# EAGLE schematic INNO_CAN_V1.1 (EAGLE 7.7.0)

## Sheet 1 of 8: POWER LAYER
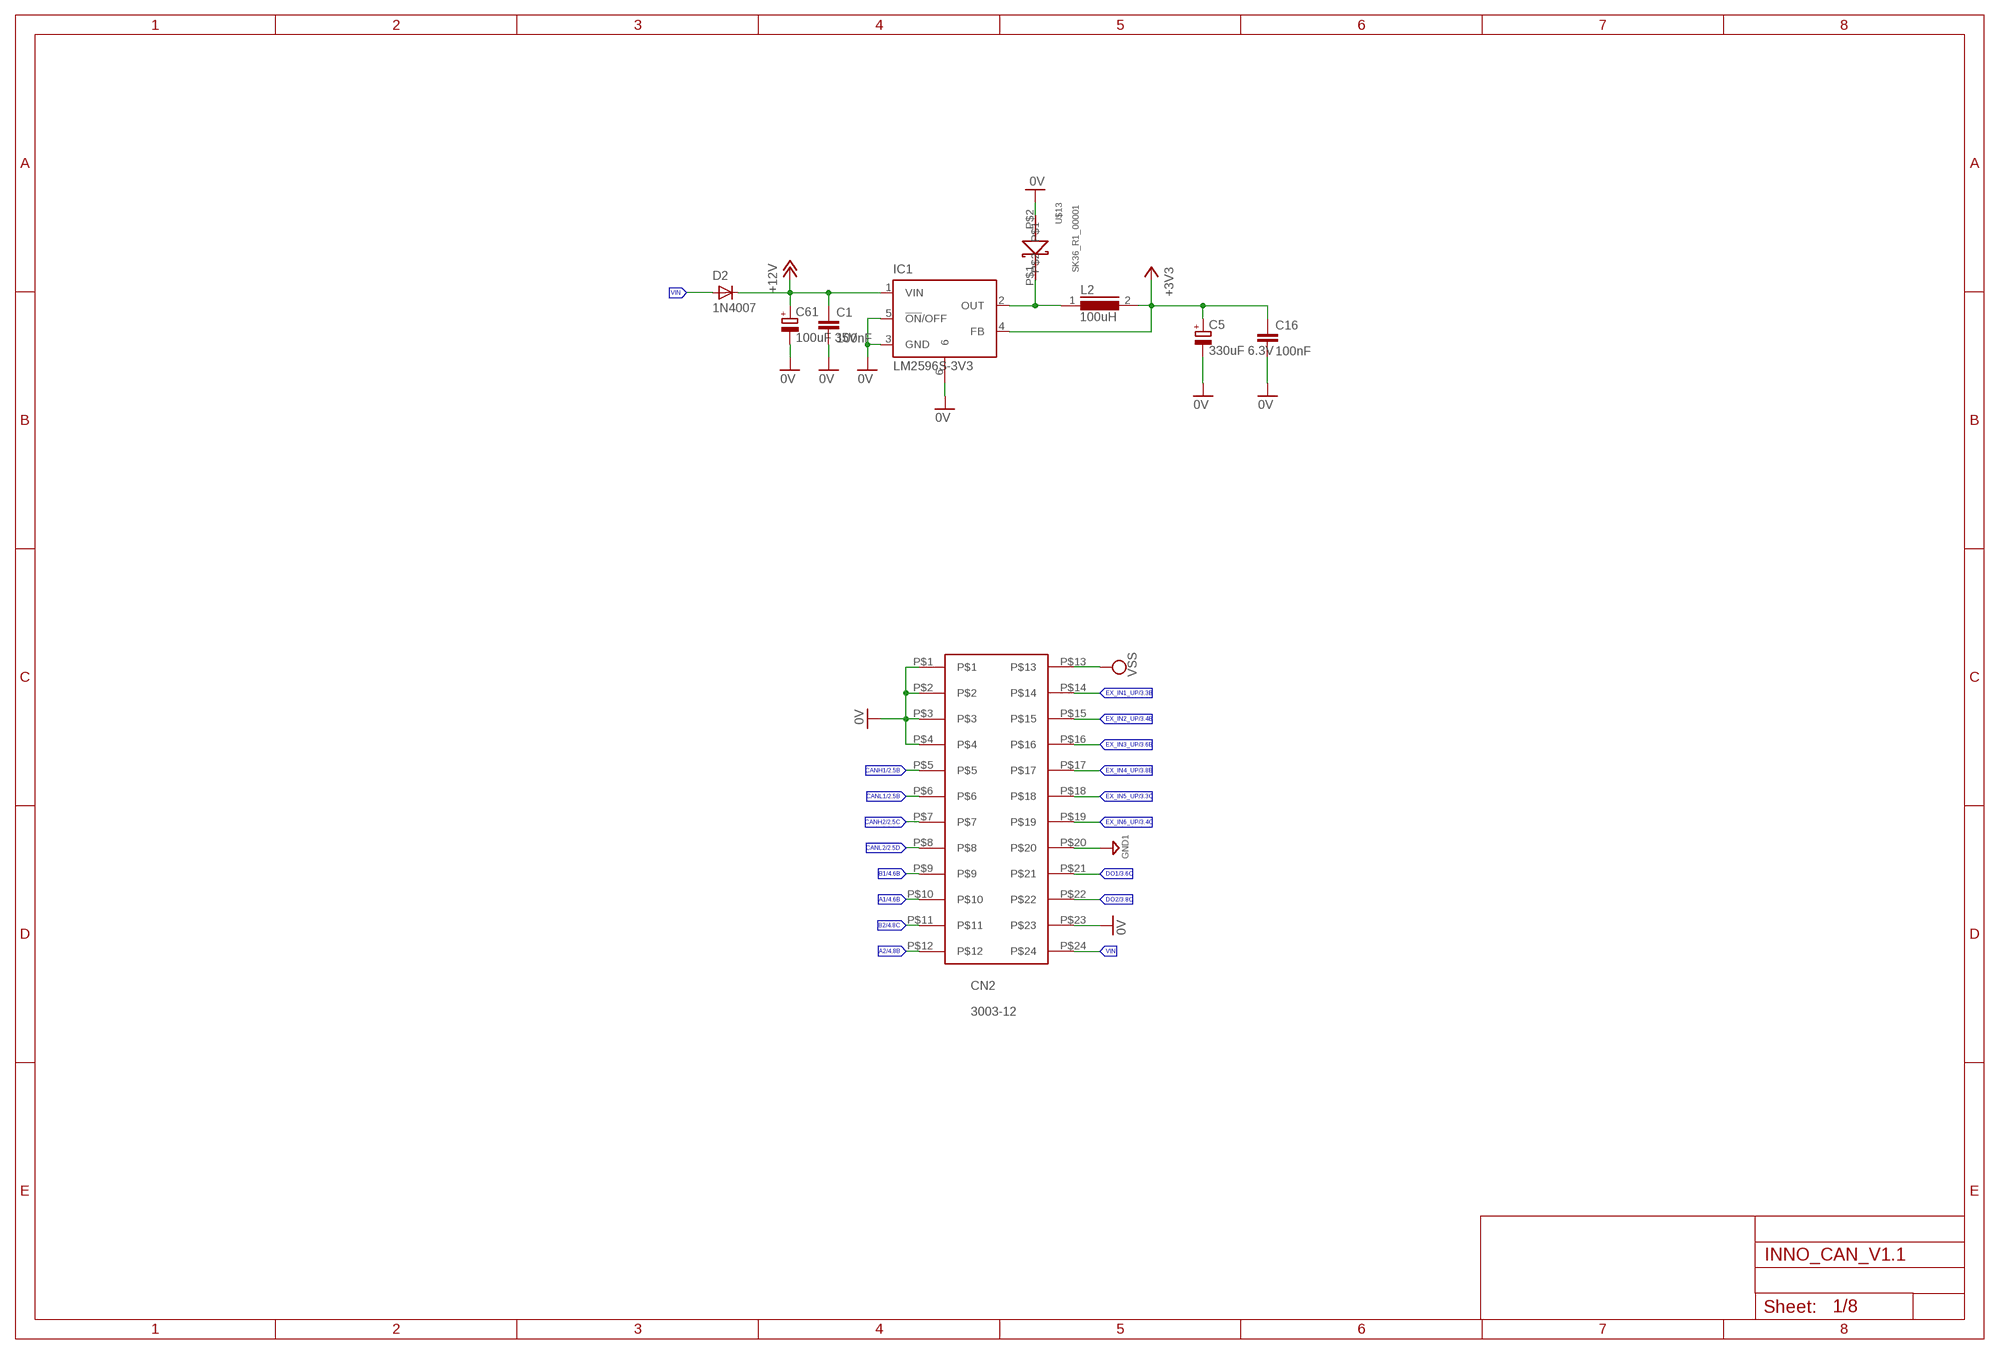
[diagram p0: schematic, sheet 1]

### Parts
C1  100nF  C-EUC0603  [C0603]
C5  330uF 6.3V  CPOL-EUE2.5-6  [E2,5-6]
C16  100nF  C-EUC0603  [C0603]
C61  100uF 35V  CPOL-EUE5-6  [E5-6]
CN2  3003-12  [3003-12]
D2  1N4007  GF1  [SMA-DO214AC]
IC1  LM2596S-3V3  LM2596S  [TO263-5]
L2  100uH  DR127  [DR127]
U$13  SK36_R1_00001  B540C_DIODE  [SMC]

### Nets
0V: C1.2 C5.- C16.2 C61.- CN2.P$1 CN2.P$2 CN2.P$3 CN2.P$4 CN2.P$23 IC1.3(GND) IC1.5(!ON!/OFF) IC1.6 U$13.P$2 ; also sheet 2,3,4,5,6,7,8
+3V3: C5.+ C16.1 IC1.4(FB) L2.2 ; also sheet 3,4,5,6,7,8
+12V: C1.1 C61.+ D2.K(C) IC1.1(VIN) ; also sheet 3
A1: CN2.P$10 ; also sheet 4
A2: CN2.P$12 ; also sheet 4
B1: CN2.P$9 ; also sheet 4
B2: CN2.P$11 ; also sheet 4
CANH1: CN2.P$5 ; also sheet 2
CANH2: CN2.P$7 ; also sheet 2
CANL1: CN2.P$6 ; also sheet 2
CANL2: CN2.P$8 ; also sheet 2
DO1: CN2.P$21 ; also sheet 3
DO2: CN2.P$22 ; also sheet 3
EX_IN1_UP: CN2.P$14 ; also sheet 3
EX_IN2_UP: CN2.P$15 ; also sheet 3
EX_IN3_UP: CN2.P$16 ; also sheet 3
EX_IN4_UP: CN2.P$17 ; also sheet 3
EX_IN5_UP: CN2.P$18 ; also sheet 3
EX_IN6_UP: CN2.P$19 ; also sheet 3
GND1: CN2.P$20 ; also sheet 3
N$216: IC1.2(OUT) L2.1 U$13.P$1
VIN: CN2.P$24 D2.A
VSS: CN2.P$13 ; also sheet 3

## Sheet 2 of 8: CAN LAYER
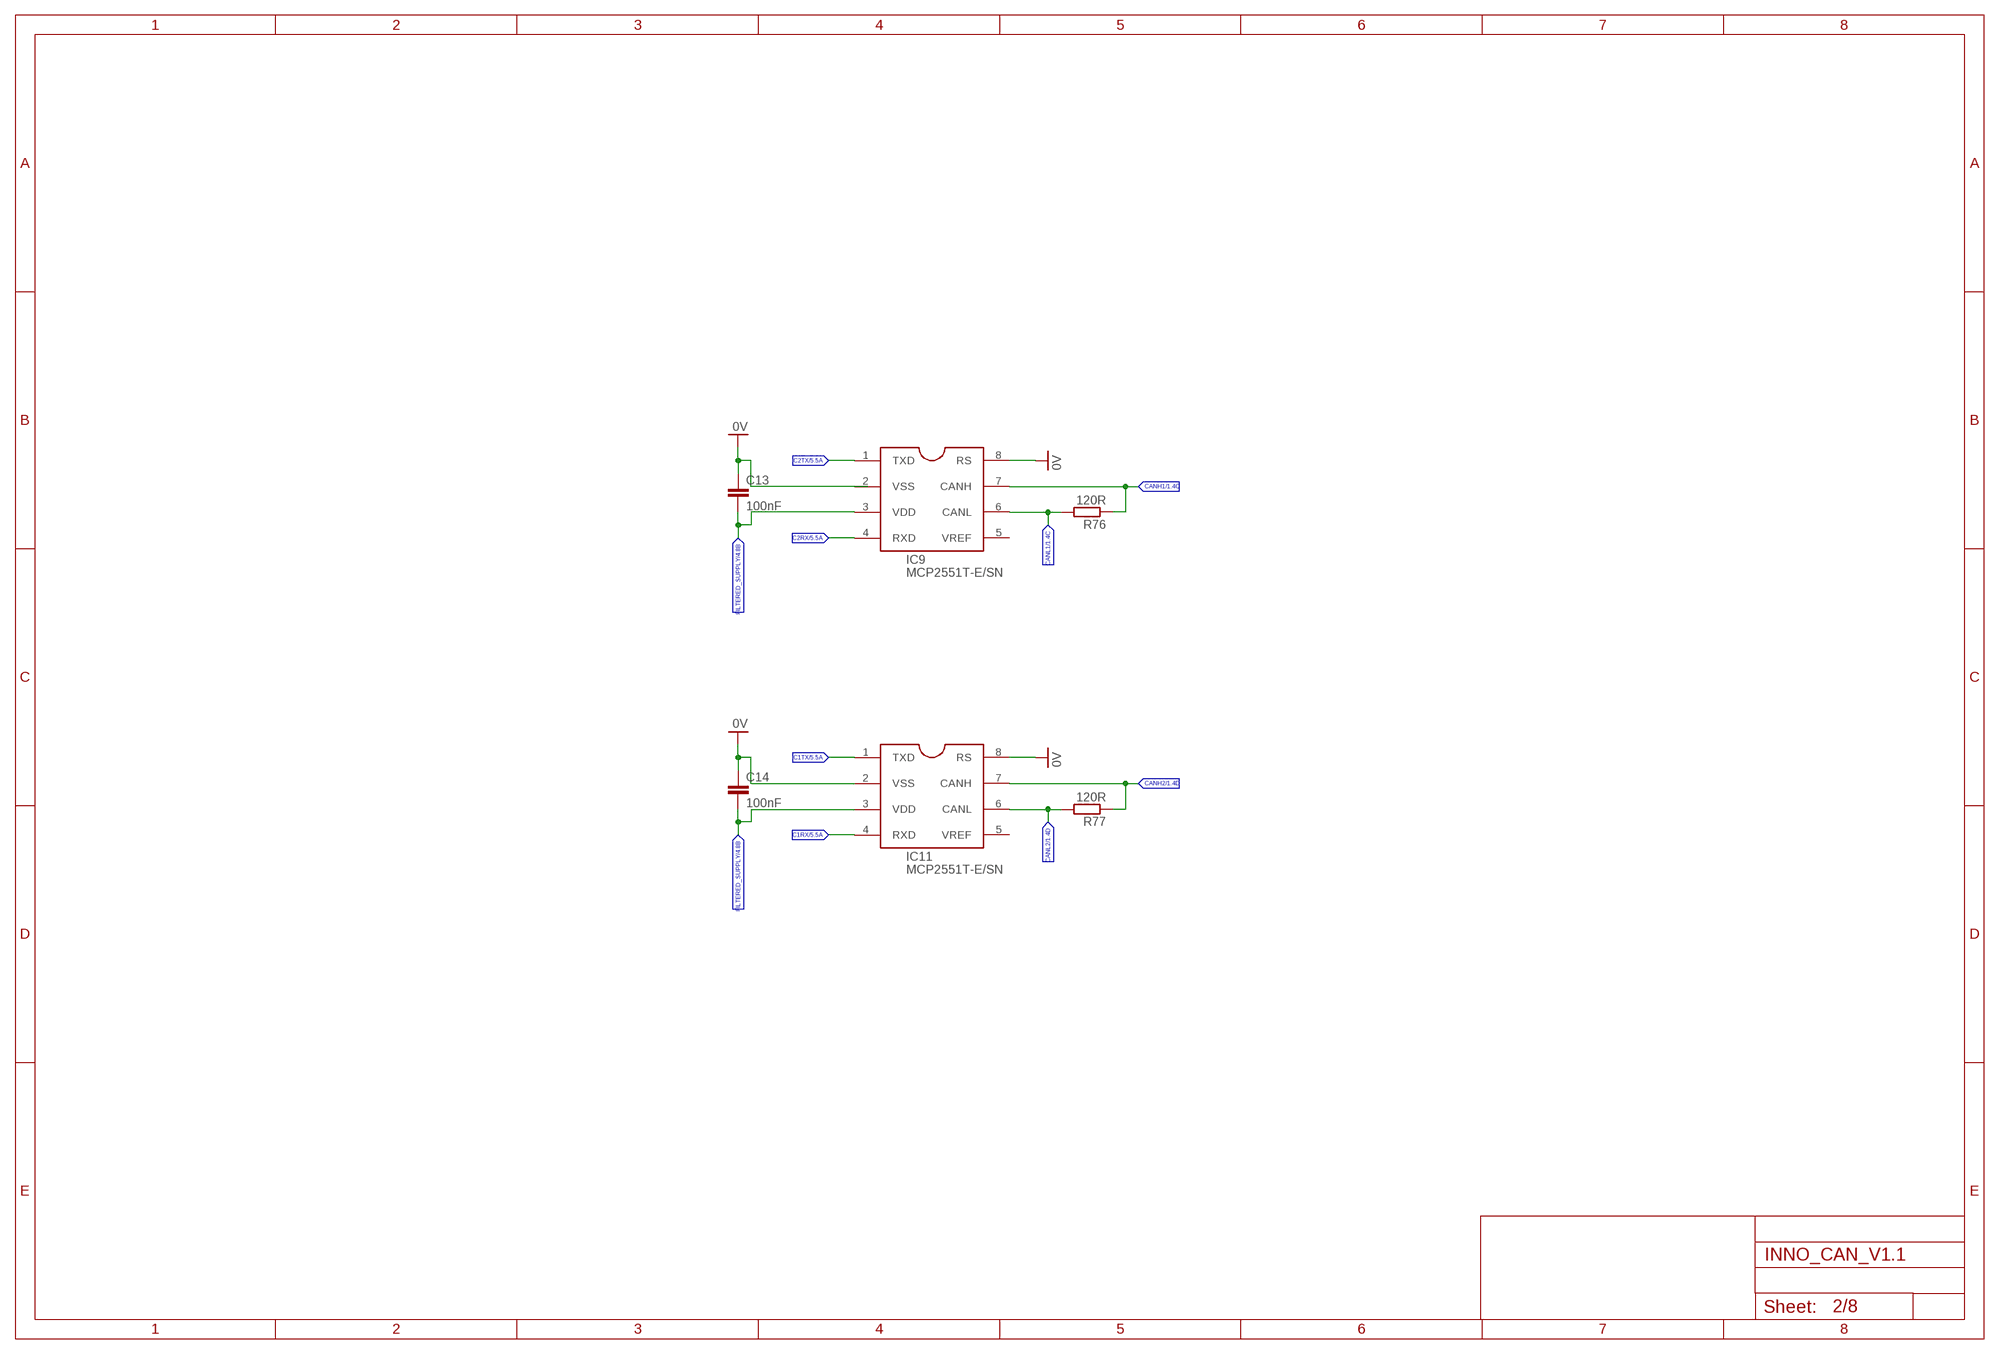
[diagram p1: schematic, sheet 2]

### Parts
C13  100nF  C-EUC0603K  [C0603K]
C14  100nF  C-EUC0603K  [C0603K]
IC9  MCP2551T-E/SN  [SOIC08]
IC11  MCP2551T-E/SN  [SOIC08]
R76  120R  R-EU_R0603  [R0603]
R77  120R  R-EU_R0603  [R0603]

### Nets
0V: C13.1 C14.1 IC9.8(RS) IC11.2(VSS) IC11.8(RS) ; also sheet 1,3,4,5,6,7,8
C1RX: IC11.4(RXD) ; also sheet 5
C1TX: IC11.1(TXD) ; also sheet 5
C2RX: IC9.4(RXD) ; also sheet 5
C2TX: IC9.1(TXD) ; also sheet 5
CANH1: IC9.7(CANH) R76.1 ; also sheet 1
CANH2: IC11.7(CANH) R77.1 ; also sheet 1
CANL1: IC9.6(CANL) R76.2 ; also sheet 1
CANL2: IC11.6(CANL) R77.2 ; also sheet 1
FILTERED_SUPPLY: C13.2 C14.2 IC9.3(VDD) IC11.3(VDD) ; also sheet 4
Unconnected: IC9.2(VSS) IC9.5(VREF) IC11.5(VREF)

## Sheet 3 of 8: PERIPHERLAS
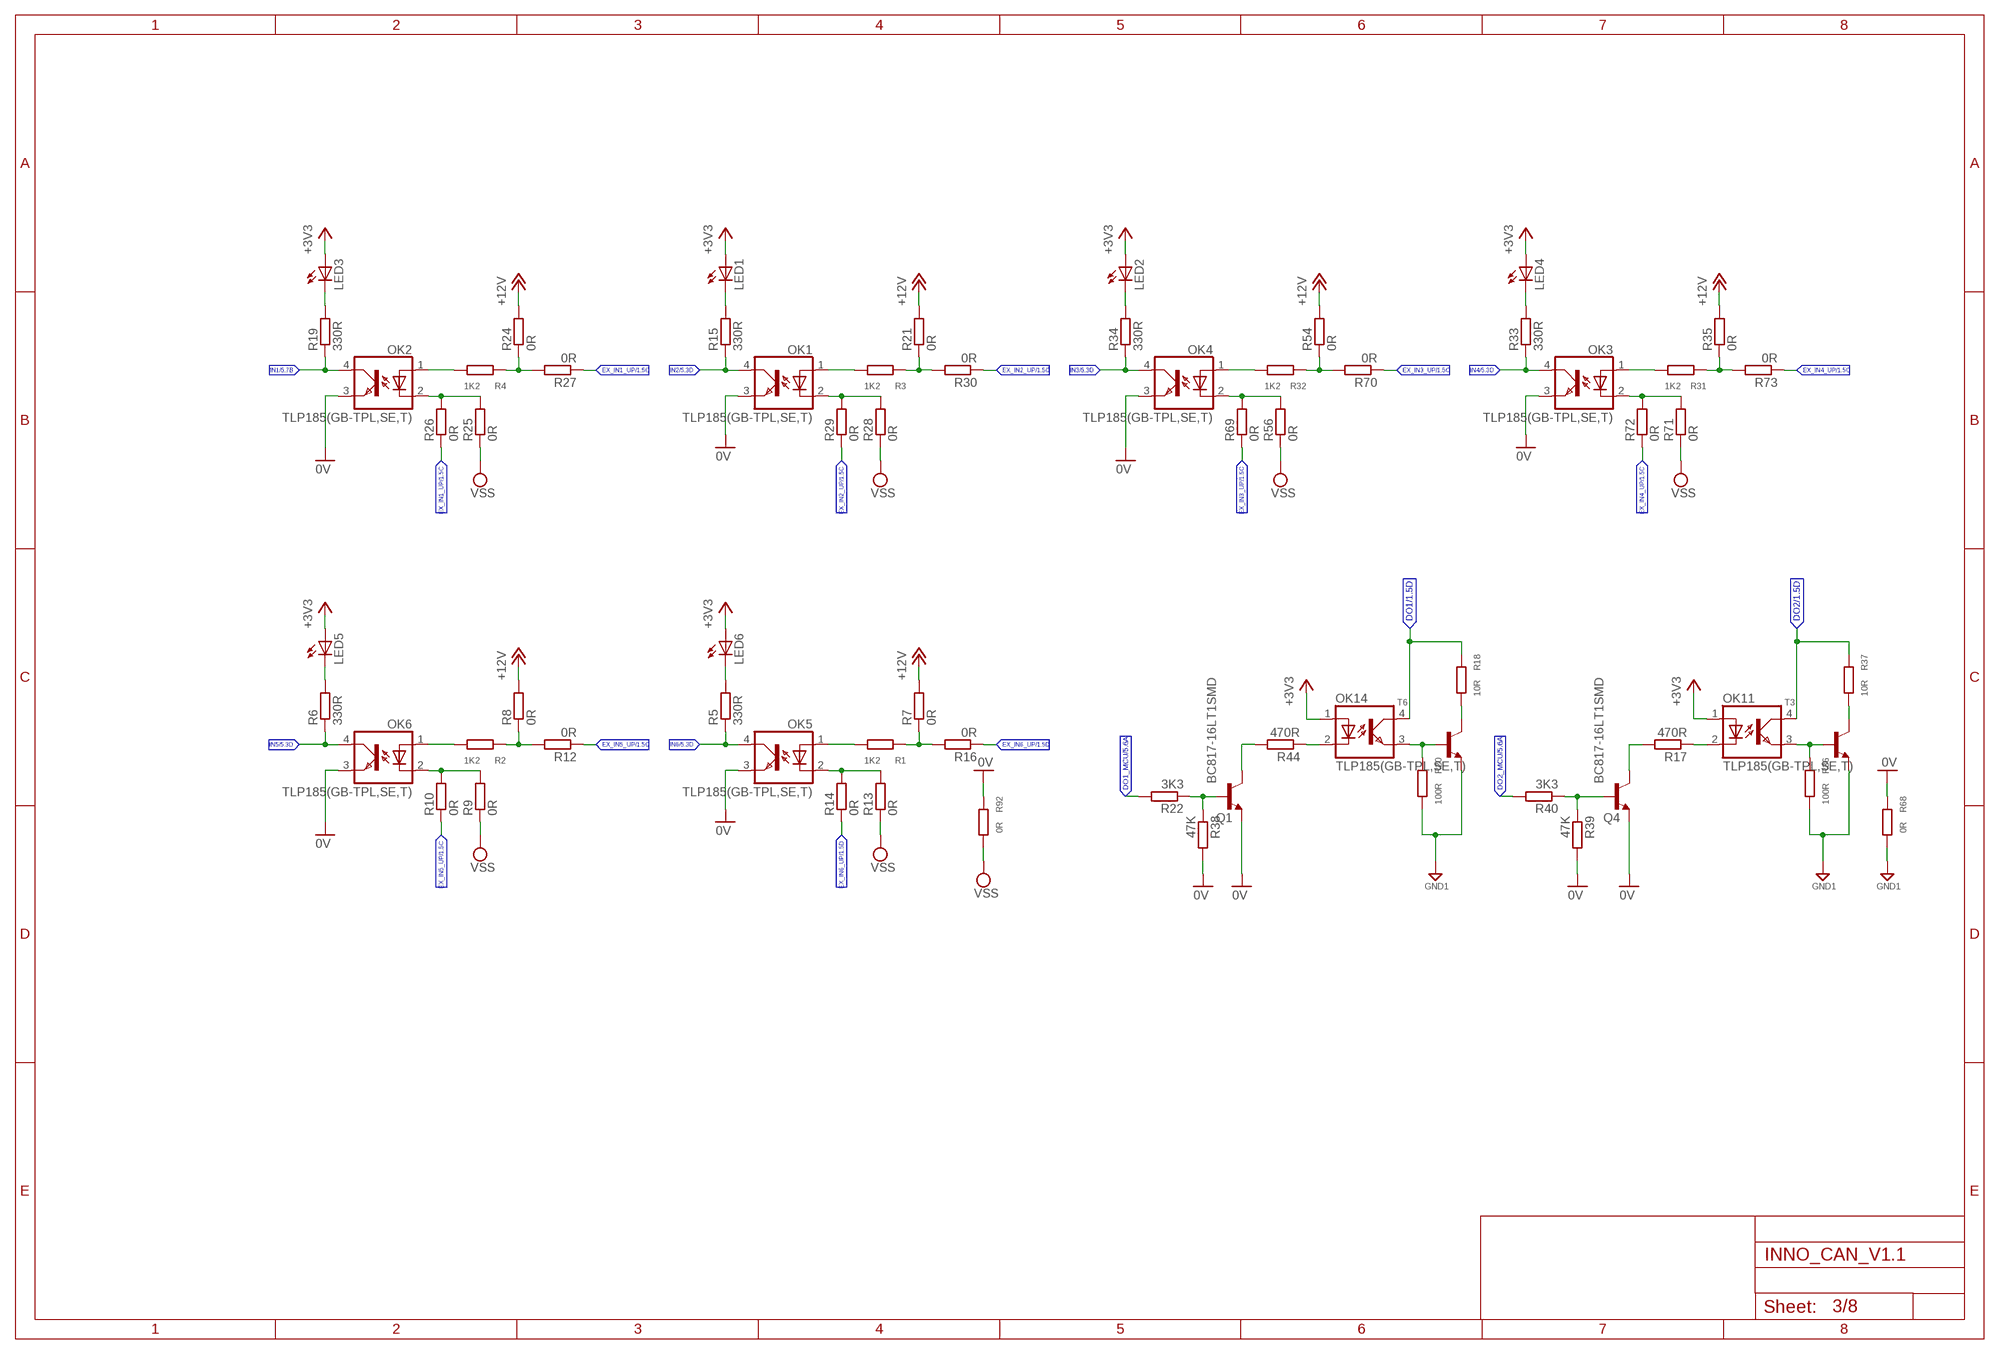
[diagram p2: schematic, sheet 3]

### Parts
LED1  LEDCHIPLED_0805  [CHIPLED_0805]
LED2  LEDCHIPLED_0805  [CHIPLED_0805]
LED3  LEDCHIPLED_0805  [CHIPLED_0805]
LED4  LEDCHIPLED_0805  [CHIPLED_0805]
LED5  LEDCHIPLED_0805  [CHIPLED_0805]
LED6  LEDCHIPLED_0805  [CHIPLED_0805]
OK1  TLP185(GB-TPL,SE,T)  LTV816S  [SMD4]
OK2  TLP185(GB-TPL,SE,T)  LTV816S  [SMD4]
OK3  TLP185(GB-TPL,SE,T)  LTV816S  [SMD4]
OK4  TLP185(GB-TPL,SE,T)  LTV816S  [SMD4]
OK5  TLP185(GB-TPL,SE,T)  LTV816S  [SMD4]
OK6  TLP185(GB-TPL,SE,T)  LTV816S  [SMD4]
OK11  TLP185(GB-TPL,SE,T)  LTV816S  [SMD4]
OK14  TLP185(GB-TPL,SE,T)  LTV816S  [SMD4]
Q1  BC817-16LT1SMD  [SOT23-BEC]
Q4  BC817-16LT1SMD  [SOT23-BEC]
R1  1K2  R-EU_M0805  [M0805]
R2  1K2  R-EU_M0805  [M0805]
R3  1K2  R-EU_M0805  [M0805]
R4  1K2  R-EU_M0805  [M0805]
R5  330R  R-EU_R0603  [R0603]
R6  330R  R-EU_R0603  [R0603]
R7  0R  R-EU_R0603  [R0603]
R8  0R  R-EU_R0603  [R0603]
R9  0R  R-EU_R0603  [R0603]
R10  0R  R-EU_R0603  [R0603]
R12  0R  R-EU_R0603  [R0603]
R13  0R  R-EU_R0603  [R0603]
R14  0R  R-EU_R0603  [R0603]
R15  330R  R-EU_R0603  [R0603]
R16  0R  R-EU_R0603  [R0603]
R17  470R  R-EU_R0603  [R0603]
R18  10R  R-EU_M0805  [M0805]
R19  330R  R-EU_R0603  [R0603]
R20  100R  R-EU_M0805  [M0805]
R21  0R  R-EU_R0603  [R0603]
R22  3K3  R-EU_R0603  [R0603]
R24  0R  R-EU_R0603  [R0603]
R25  0R  R-EU_R0603  [R0603]
R26  0R  R-EU_R0603  [R0603]
R27  0R  R-EU_R0603  [R0603]
R28  0R  R-EU_R0603  [R0603]
R29  0R  R-EU_R0603  [R0603]
R30  0R  R-EU_R0603  [R0603]
R31  1K2  R-EU_M0805  [M0805]
R32  1K2  R-EU_M0805  [M0805]
R33  330R  R-EU_R0603  [R0603]
R34  330R  R-EU_R0603  [R0603]
R35  0R  R-EU_R0603  [R0603]
R36  100R  R-EU_M0805  [M0805]
R37  10R  R-EU_M0805  [M0805]
R38  47K  R-EU_R0603  [R0603]
R39  47K  R-EU_R0603  [R0603]
R40  3K3  R-EU_R0603  [R0603]
R44  470R  R-EU_R0603  [R0603]
R54  0R  R-EU_R0603  [R0603]
R56  0R  R-EU_R0603  [R0603]
R68  0R  R-EU_M0805  [M0805]
R69  0R  R-EU_R0603  [R0603]
R70  0R  R-EU_R0603  [R0603]
R71  0R  R-EU_R0603  [R0603]
R72  0R  R-EU_R0603  [R0603]
R73  0R  R-EU_R0603  [R0603]
R92  0R  R-EU_M0805  [M0805]
T3  BC817-16LT1-NPN-SOT23-BEC  [SOT23-BEC]
T6  BC817-16LT1-NPN-SOT23-BEC  [SOT23-BEC]

### Nets
0V: OK1.3(EMIT) OK2.3(EMIT) OK3.3(EMIT) OK4.3(EMIT) OK5.3(EMIT) OK6.3(EMIT) Q1.E Q4.E R38.2 R39.2 R68.1 R92.1 ; also sheet 1,2,4,5,6,7,8
+3V3: LED1.A LED2.A LED3.A LED4.A LED5.A LED6.A OK11.1(A) OK14.1(A) ; also sheet 1,4,5,6,7,8
+12V: R7.2 R8.2 R21.2 R24.2 R35.2 R54.2 ; also sheet 1
DO1: OK14.4(COL) R18.1 ; also sheet 1
DO1_MCU: R22.2 ; also sheet 5
DO2: OK11.4(COL) R37.1 ; also sheet 1
DO2_MCU: R40.2 ; also sheet 5
EX_IN0_UP1: R3.1 R21.1 R30.2
EX_IN0_UP2: R31.1 R35.1 R73.2
EX_IN0_UP3: R1.1 R7.1 R16.2
EX_IN1_UP: R26.1 R27.1 ; also sheet 1
EX_IN1_UP1: R4.1 R24.1 R27.2
EX_IN1_UP2: R32.1 R54.1 R70.2
EX_IN1_UP3: R2.1 R8.1 R12.2
EX_IN2_UP: R29.1 R30.1 ; also sheet 1
EX_IN3_UP: R69.1 R70.1 ; also sheet 1
EX_IN4_UP: R72.1 R73.1 ; also sheet 1
EX_IN5_UP: R10.1 R12.1 ; also sheet 1
EX_IN6_UP: R14.1 R16.1 ; also sheet 1
GND1: R20.2 R36.2 R68.2 T3.E T6.E ; also sheet 1
IN1: OK2.4(COL) R19.1 ; also sheet 5
IN2: OK1.4(COL) R15.1 ; also sheet 5
IN3: OK4.4(COL) R34.1 ; also sheet 5
IN4: OK3.4(COL) R33.1 ; also sheet 5
IN5: OK6.4(COL) R6.1 ; also sheet 5
IN6: OK5.4(COL) R5.1 ; also sheet 5
N$5: OK1.1(A) R3.2
N$7: OK5.1(A) R1.2
N$10: OK2.1(A) R4.2
N$11: OK6.1(A) R2.2
N$12: OK2.2(C) R25.2 R26.2
N$13: OK6.2(C) R9.2 R10.2
N$14: OK5.2(C) R13.2 R14.2
N$15: OK1.2(C) R28.2 R29.2
N$16: LED5.C R6.2
N$17: LED6.C R5.2
N$18: OK11.2(C) R17.1
N$19: R37.2 T3.C
N$20: OK11.3(EMIT) R36.1 T3.B
N$21: Q1.C R44.2
N$22: Q4.C R17.2
N$23: Q1.B R22.1 R38.1
N$24: OK3.1(A) R31.2
N$25: Q4.B R39.1 R40.1
N$26: OK4.1(A) R32.2
N$38: OK4.2(C) R56.2 R69.2
N$39: OK3.2(C) R71.2 R72.2
N$40: LED3.C R19.2
N$42: LED1.C R15.2
N$43: LED2.C R34.2
N$44: LED4.C R33.2
N$56: OK14.2(C) R44.1
N$57: R18.2 T6.C
N$58: OK14.3(EMIT) R20.1 T6.B
VSS: R9.1 R13.1 R25.1 R28.1 R56.1 R71.1 R92.2 ; also sheet 1

## Sheet 4 of 8: RS-232 && RS-485
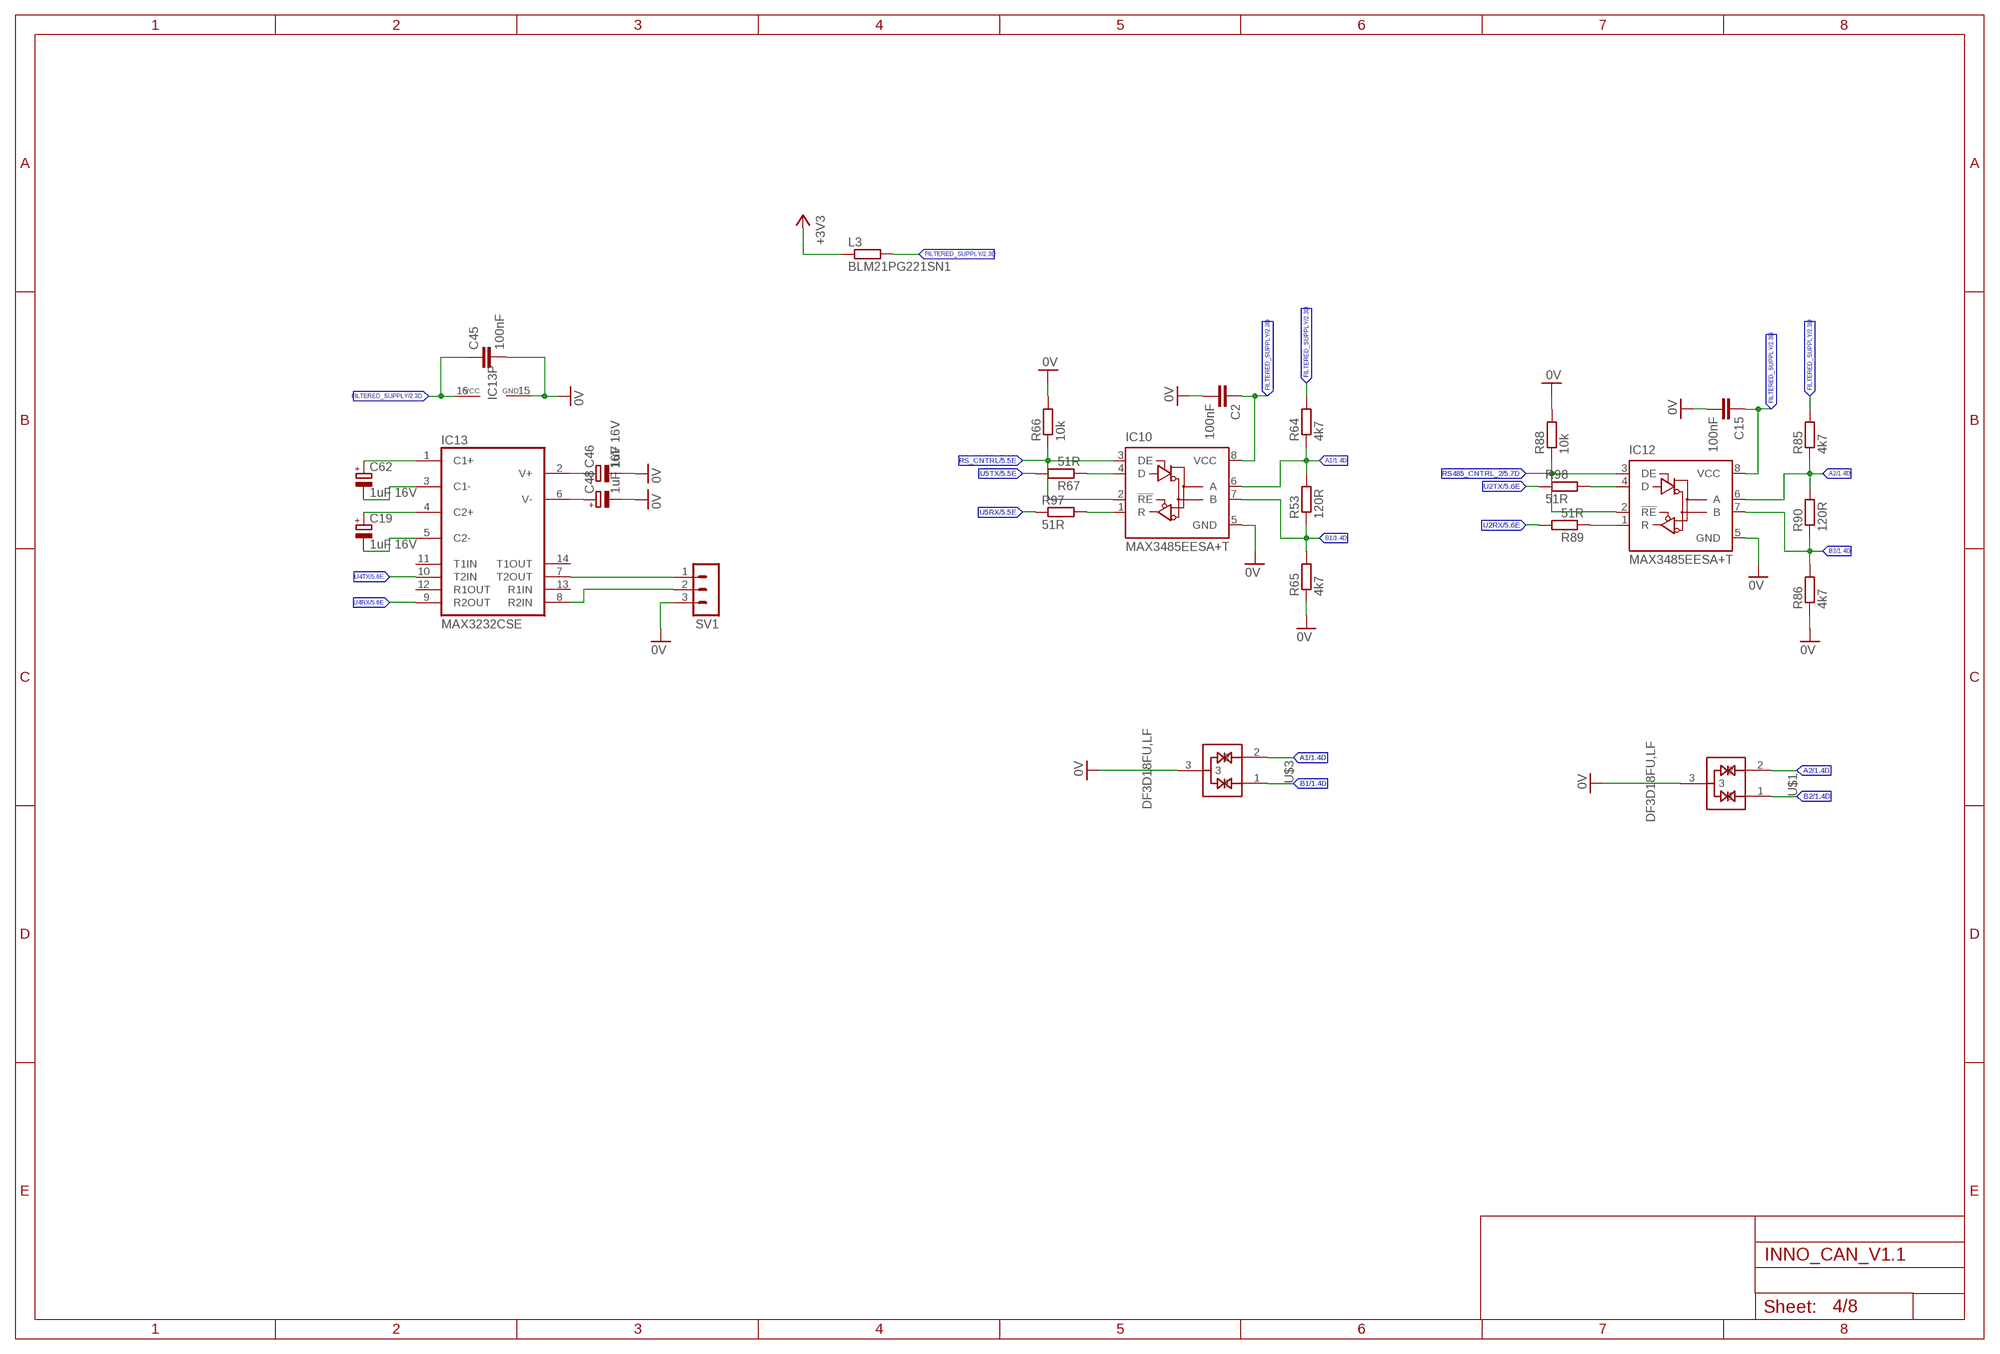
[diagram p3: schematic, sheet 4]

### Parts
C2  100nF  C-EUC0603  [C0603]
C15  100nF  C-EUC0603  [C0603]
C19  1uF 16V  CPOL-EUSMCZ  [SMC_Z]
C45  100nF  C-EUC0603  [C0603]
C46  1uF 16V  CPOL-EUSMCZ  [SMC_Z]
C48  1uF 16V  CPOL-EUSMCZ  [SMC_Z]
C62  1uF 16V  CPOL-EUSMCZ  [SMC_Z]
IC10  MAX3485EESA+T  75176AD  [D_R-PDSO-G8]
IC12  MAX3485EESA+T  75176AD  [D_R-PDSO-G8]
IC13  MAX3232CSE  [SO16]
L3  BLM21PG221SN1  R-EU_R0805  [R0805]
R53  120R  R-EU_R0603  [R0603]
R64  4k7  R-EU_R0603  [R0603]
R65  4k7  R-EU_R0603  [R0603]
R66  10k  R-EU_R0603  [R0603]
R67  51R  R-EU_R0603  [R0603]
R85  4k7  R-EU_R0603  [R0603]
R86  4k7  R-EU_R0603  [R0603]
R88  10k  R-EU_R0603  [R0603]
R89  51R  R-EU_R0603  [R0603]
R90  120R  R-EU_R0603  [R0603]
R97  51R  R-EU_R0603  [R0603]
R98  51R  R-EU_R0603  [R0603]
SV1  MA03-1  [MA03-1]
U$1  DF3D18FU,LF  [SOT323]
U$3  DF3D18FU,LF  [SOT323]

### Nets
0V: C2.2 C15.2 C45.2 C46.- C48.- IC10.5(GND) IC12.5(GND) IC13.15(GND) R65.1 R66.2 R86.1 R88.2 SV1.3 U$1.3 U$3.3 ; also sheet 1,2,3,5,6,7,8
+3V3: L3.1 ; also sheet 1,3,5,6,7,8
A1: IC10.6(A) R53.2 R64.1 U$3.2 ; also sheet 1
A2: IC12.6(A) R85.1 R90.2 U$1.2 ; also sheet 1
B1: IC10.7(B) R53.1 R65.2 U$3.1 ; also sheet 1
B2: IC12.7(B) R86.2 R90.1 U$1.1 ; also sheet 1
FILTERED_SUPPLY: C2.1 C15.1 C45.1 IC10.8(VCC) IC12.8(VCC) IC13.16(VCC) L3.2 R64.2 R85.2 ; also sheet 2
N$1: C62.- IC13.3(C1-)
N$2: C19.+ IC13.4(C2+)
N$4: C46.+ IC13.2(V+)
N$6: C48.+ IC13.6(V-)
N$48: C62.+ IC13.1(C1+)
N$52: IC13.7(T2OUT) SV1.1
N$53: IC13.8(R2IN) SV1.2
N$59: C19.- IC13.5(C2-)
N$61: IC10.1(R) R97.2
N$62: IC10.4(D) R67.1
N$63: IC12.1(R) R89.1
N$64: IC12.4(D) R98.2
RS485_CNTRL_2: IC12.2(!RE) IC12.3(DE) R88.1 ; also sheet 5
RS_CNTRL: IC10.2(!RE) IC10.3(DE) R66.1 ; also sheet 5
U2RX: R89.2 ; also sheet 5
U2TX: R98.1 ; also sheet 5
U4RX: IC13.9(R2OUT) ; also sheet 5
U4TX: IC13.10(T2IN) ; also sheet 5
U5RX: R97.1 ; also sheet 5
U5TX: R67.2 ; also sheet 5
Unconnected: IC13.11(T1IN) IC13.12(R1OUT) IC13.13(R1IN) IC13.14(T1OUT)

## Sheet 5 of 8: MCU CONECTIONS
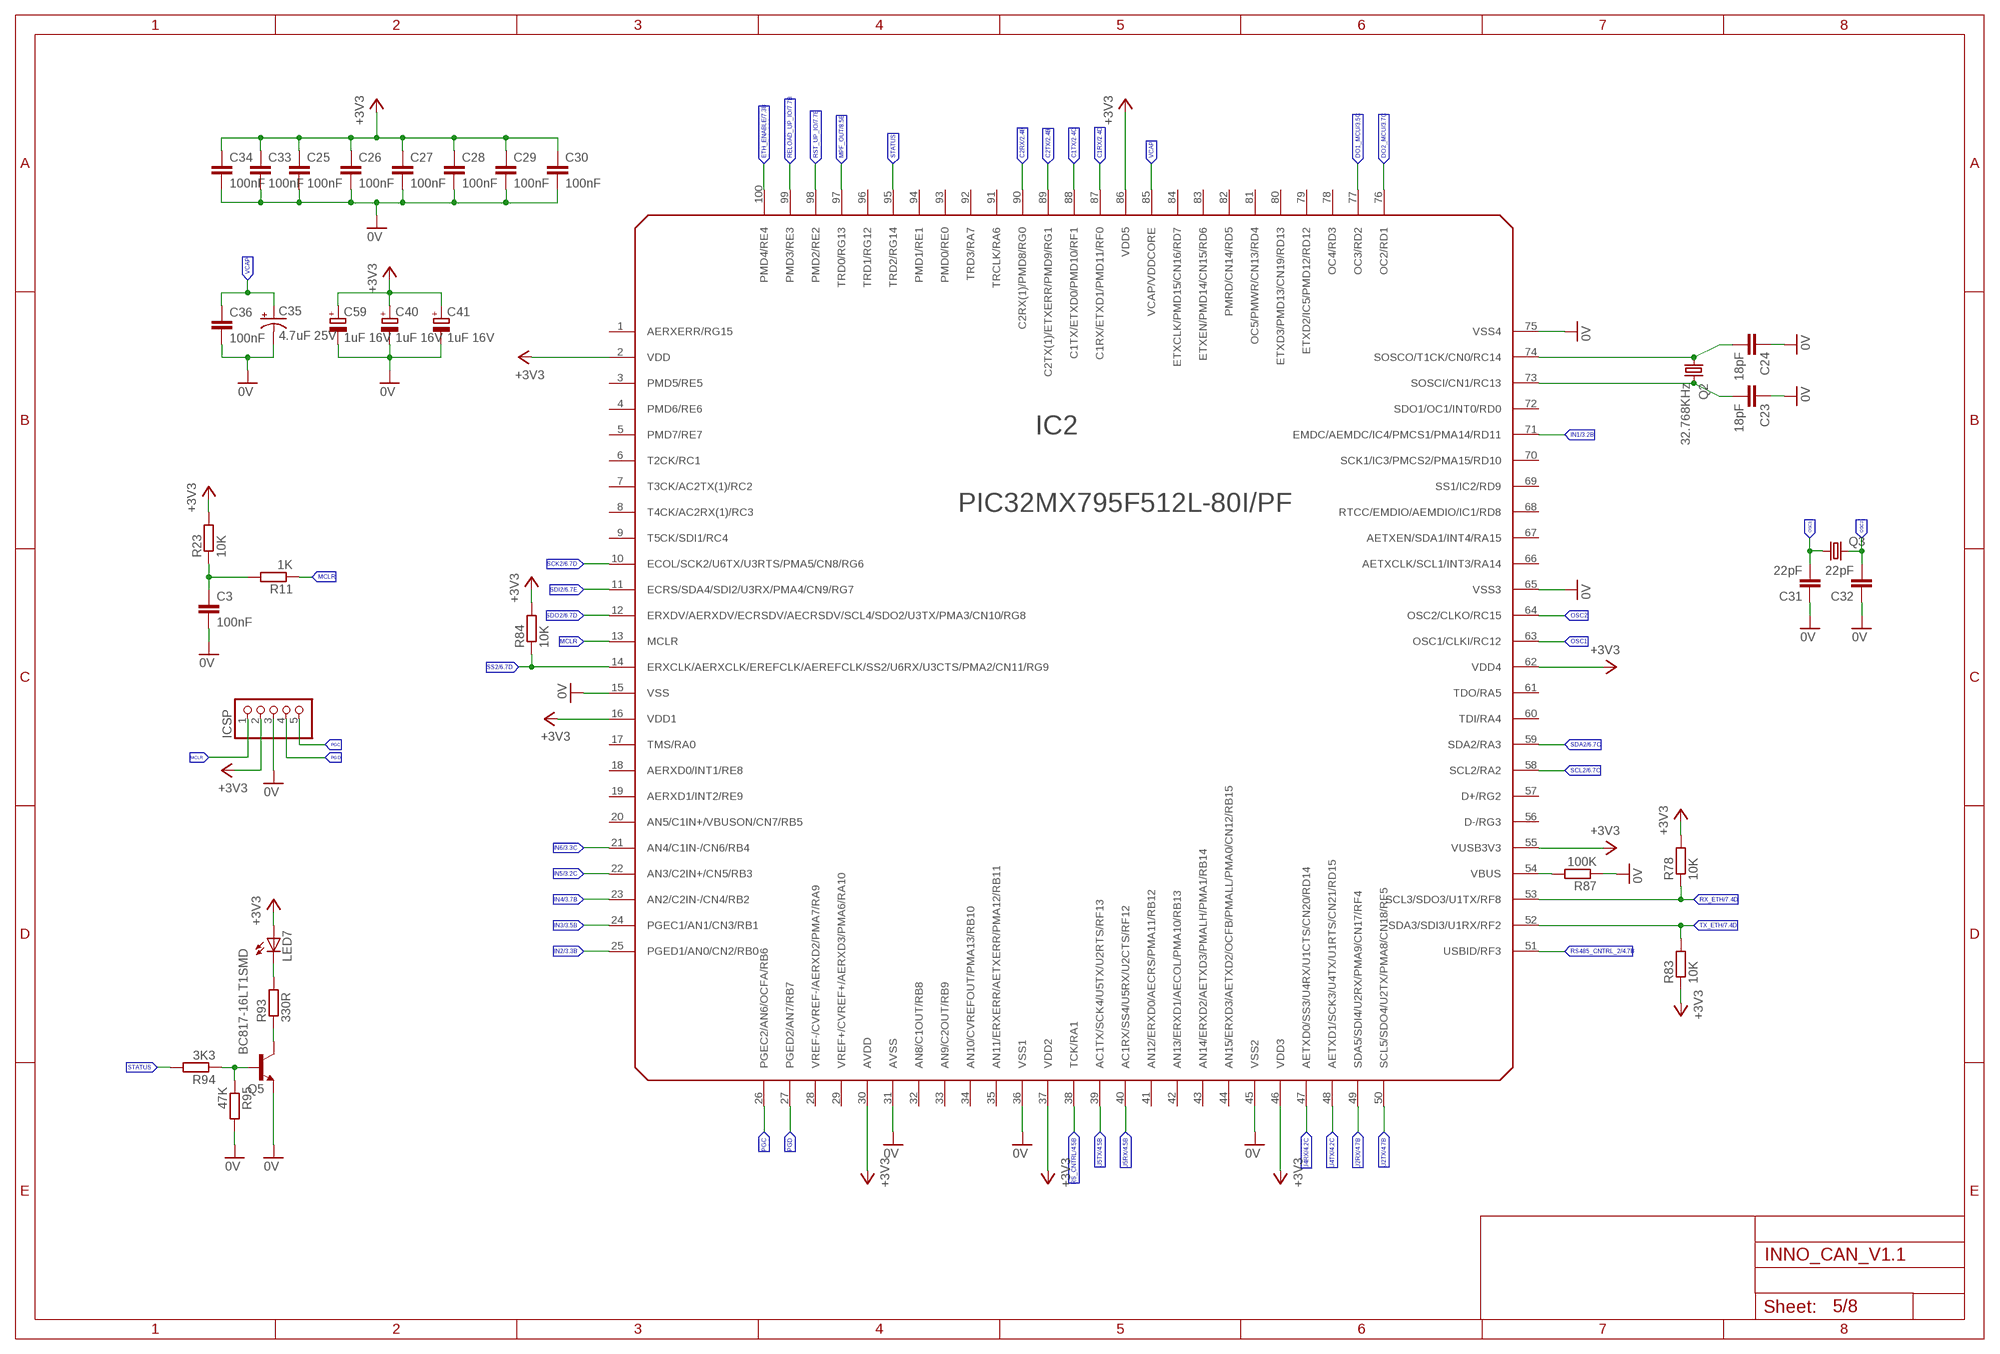
[diagram p4: schematic, sheet 5]

### Parts
C3  100nF  C-EUC0603K  [C0603K]
C23  18pF  C-EUC0603  [C0603]
C24  18pF  C-EUC0603  [C0603]
C25  100nF  C-EUC0603K  [C0603K]
C26  100nF  C-EUC0603K  [C0603K]
C27  100nF  C-EUC0603K  [C0603K]
C28  100nF  C-EUC0603K  [C0603K]
C29  100nF  C-EUC0603K  [C0603K]
C30  100nF  C-EUC0603K  [C0603K]
C31  22pF  C-EUC0805  [C0805]
C32  22pF  C-EUC0805  [C0805]
C33  100nF  C-EUC0603K  [C0603K]
C34  100nF  C-EUC0603K  [C0603K]
C35  4.7uF 25V  CPOL-USA/3216-18R  [A/3216-18R]
C36  100nF  C-EUC0603  [C0603]
C40  1uF 16V  CPOL-EUSMCZ  [SMC_Z]
C41  1uF 16V  CPOL-EUSMCZ  [SMC_Z]
C59  1uF 16V  CPOL-EUSMCZ  [SMC_Z]
IC2  PIC32MX795F512L-80I/PF  [TQFP100-14X14]
ICSP  PINHD-1X5  [1X05]
LED7  LEDCHIPLED_0805  [CHIPLED_0805]
Q2  32.768KHz  CRYSTALTC26V  [TC26V]
Q3  CRYSTALHC49UP  [HC49UP]
Q5  BC817-16LT1SMD  [SOT23-BEC]
R11  1K  R-EU_R0603  [R0603]
R23  10K  R-EU_R0603  [R0603]
R78  10K  R-EU_R0603  [R0603]
R83  10K  R-EU_R0603  [R0603]
R84  10K  R-EU_R0603  [R0603]
R87  100K  R-EU_R0603  [R0603]
R93  330R  R-EU_R0603  [R0603]
R94  3K3  R-EU_R0603  [R0603]
R95  47K  R-EU_R0603  [R0603]

### Nets
0V: C3.2 C23.1 C24.1 C25.2 C26.2 C27.2 C28.2 C29.2 C30.2 C31.1 C32.1 C33.2 C34.2 C35.- C36.2 C40.- C41.- C59.- IC2.15(VSS) IC2.31(AVSS) IC2.36(VSS1) IC2.45(VSS2) IC2.65(VSS3) IC2.75(VSS4) ICSP.3 Q5.E R87.1 R95.2 ; also sheet 1,2,3,4,6,7,8
+3V3: C25.1 C26.1 C27.1 C28.1 C29.1 C30.1 C33.1 C34.1 C40.+ C41.+ C59.+ IC2.2(VDD) IC2.16(VDD1) IC2.30(AVDD) IC2.37(VDD2) IC2.46(VDD3) IC2.55(VUSB3V3) IC2.62(VDD4) IC2.86(VDD5) ICSP.2 LED7.A R23.2 R78.2 R83.1 R84.2 ; also sheet 1,3,4,6,7,8
C1RX: IC2.87(C1RX/ETXD1/PMD11/RF0) ; also sheet 2
C1TX: IC2.88(C1TX/ETXD0/PMD10/RF1) ; also sheet 2
C2RX: IC2.90(C2RX(1)/PMD8/RG0) ; also sheet 2
C2TX: IC2.89(C2TX(1)/ETXERR/PMD9/RG1) ; also sheet 2
DO1_MCU: IC2.77(OC3/RD2) ; also sheet 3
DO2_MCU: IC2.76(OC2/RD1) ; also sheet 3
ETH_ENABLE: IC2.100(PMD4/RE4) ; also sheet 7
IN1: IC2.71(EMDC/AEMDC/IC4/PMCS1/PMA14/RD11) ; also sheet 3
IN2: IC2.25(PGED1/AN0/CN2/RB0) ; also sheet 3
IN3: IC2.24(PGEC1/AN1/CN3/RB1) ; also sheet 3
IN4: IC2.23(AN2/C2IN-/CN4/RB2) ; also sheet 3
IN5: IC2.22(AN3/C2IN+/CN5/RB3) ; also sheet 3
IN6: IC2.21(AN4/C1IN-/CN6/RB4) ; also sheet 3
MCLR: IC2.13(MCLR) ICSP.1 R11.1
MPF_OUT: IC2.97(TRD0/RG13) ; also sheet 8
N$3: C3.1 R11.2 R23.1
N$34: LED7.C R93.2
N$37: Q5.B R94.1 R95.1
N$41: C23.2 IC2.73(SOSCI/CN1/RC13) Q2.2
N$47: Q5.C R93.1
N$49: C24.2 IC2.74(SOSCO/T1CK/CN0/RC14) Q2.1
N$50: IC2.54(VBUS) R87.2
OSC1: C31.2 IC2.63(OSC1/CLKI/RC12) Q3.1
OSC2: C32.2 IC2.64(OSC2/CLKO/RC15) Q3.2
PGC: IC2.26(PGEC2/AN6/OCFA/RB6) ICSP.5
PGD: IC2.27(PGED2/AN7/RB7) ICSP.4
RELOAD_UP_IO: IC2.99(PMD3/RE3) ; also sheet 7
RS485_CNTRL_2: IC2.51(USBID/RF3) ; also sheet 4
RS_CNTRL: IC2.38(TCK/RA1) ; also sheet 4
RST_UP_IO: IC2.98(PMD2/RE2) ; also sheet 7
RX_ETH: IC2.53(SCL3/SDO3/U1TX/RF8) R78.1 ; also sheet 7
SCK2: IC2.10(ECOL/SCK2/U6TX/U3RTS/PMA5/CN8/RG6) ; also sheet 6
SCL2: IC2.58(SCL2/RA2) ; also sheet 6,8
SDA2: IC2.59(SDA2/RA3) ; also sheet 6,8
SDI2: IC2.11(ECRS/SDA4/SDI2/U3RX/PMA4/CN9/RG7) ; also sheet 6
SDO2: IC2.12(ERXDV/AERXDV/ECRSDV/AECRSDV/SCL4/SDO2/U3TX/PMA3/CN10/RG8) ; also sheet 6
SS2: IC2.14(ERXCLK/AERXCLK/EREFCLK/AEREFCLK/SS2/U6RX/U3CTS/PMA2/CN11/RG9) R84.1 ; also sheet 6
STATUS: IC2.95(TRD2/RG14) R94.2
TX_ETH: IC2.52(SDA3/SDI3/U1RX/RF2) R83.2 ; also sheet 7
U2RX: IC2.49(SDA5/SDI4/U2RX/PMA9/CN17/RF4) ; also sheet 4
U2TX: IC2.50(SCL5/SDO4/U2TX/PMA8/CN18/RF5) ; also sheet 4
U4RX: IC2.47(AETXD0/SS3/U4RX/U1CTS/CN20/RD14) ; also sheet 4
U4TX: IC2.48(AETXD1/SCK3/U4TX/U1RTS/CN21/RD15) ; also sheet 4
U5RX: IC2.40(AC1RX/SS4/U5RX/U2CTS/RF12) ; also sheet 4
U5TX: IC2.39(AC1TX/SCK4/U5TX/U2RTS/RF13) ; also sheet 4
VCAP: C35.+ C36.1 IC2.85(VCAP/VDDCORE)
Unconnected: IC2.1(AERXERR/RG15) IC2.3(PMD5/RE5) IC2.4(PMD6/RE6) IC2.5(PMD7/RE7) IC2.6(T2CK/RC1) IC2.7(T3CK/AC2TX(1)/RC2) IC2.8(T4CK/AC2RX(1)/RC3) IC2.9(T5CK/SDI1/RC4) IC2.17(TMS/RA0) IC2.18(AERXD0/INT1/RE8) IC2.19(AERXD1/INT2/RE9) IC2.20(AN5/C1IN+/VBUSON/CN7/RB5) IC2.28(VREF-/CVREF-/AERXD2/PMA7/RA9) IC2.29(VREF+/CVREF+/AERXD3/PMA6/RA10) IC2.32(AN8/C1OUT/RB8) IC2.33(AN9/C2OUT/RB9) IC2.34(AN10/CVREFOUT/PMA13/RB10) IC2.35(AN11/ERXERR/AETXERR/PMA12/RB11) IC2.41(AN12/ERXD0/AECRS/PMA11/RB12) IC2.42(AN13/ERXD1/AECOL/PMA10/RB13) IC2.43(AN14/ERXD2/AETXD3/PMALH/PMA1/RB14) IC2.44(AN15/ERXD3/AETXD2/OCFB/PMALL/PMA0/CN12/RB15) IC2.56(D-/RG3) IC2.57(D+/RG2) IC2.60(TDI/RA4) IC2.61(TDO/RA5) IC2.66(AETXCLK/SCL1/INT3/RA14) IC2.67(AETXEN/SDA1/INT4/RA15) IC2.68(RTCC/EMDIO/AEMDIO/IC1/RD8) IC2.69(SS1/IC2/RD9) IC2.70(SCK1/IC3/PMCS2/PMA15/RD10) IC2.72(SDO1/OC1/INT0/RD0) IC2.78(OC4/RD3) IC2.79(ETXD2/IC5/PMD12/RD12) IC2.80(ETXD3/PMD13/CN19/RD13) IC2.81(OC5/PMWR/CN13/RD4) IC2.82(PMRD/CN14/RD5) IC2.83(ETXEN/PMD14/CN15/RD6) IC2.84(ETXCLK/PMD15/CN16/RD7) IC2.91(TRCLK/RA6) IC2.92(TRD3/RA7) IC2.93(PMD0/RE0) IC2.94(PMD1/RE1) IC2.96(TRD1/RG12)

## Sheet 6 of 8: MEMORY
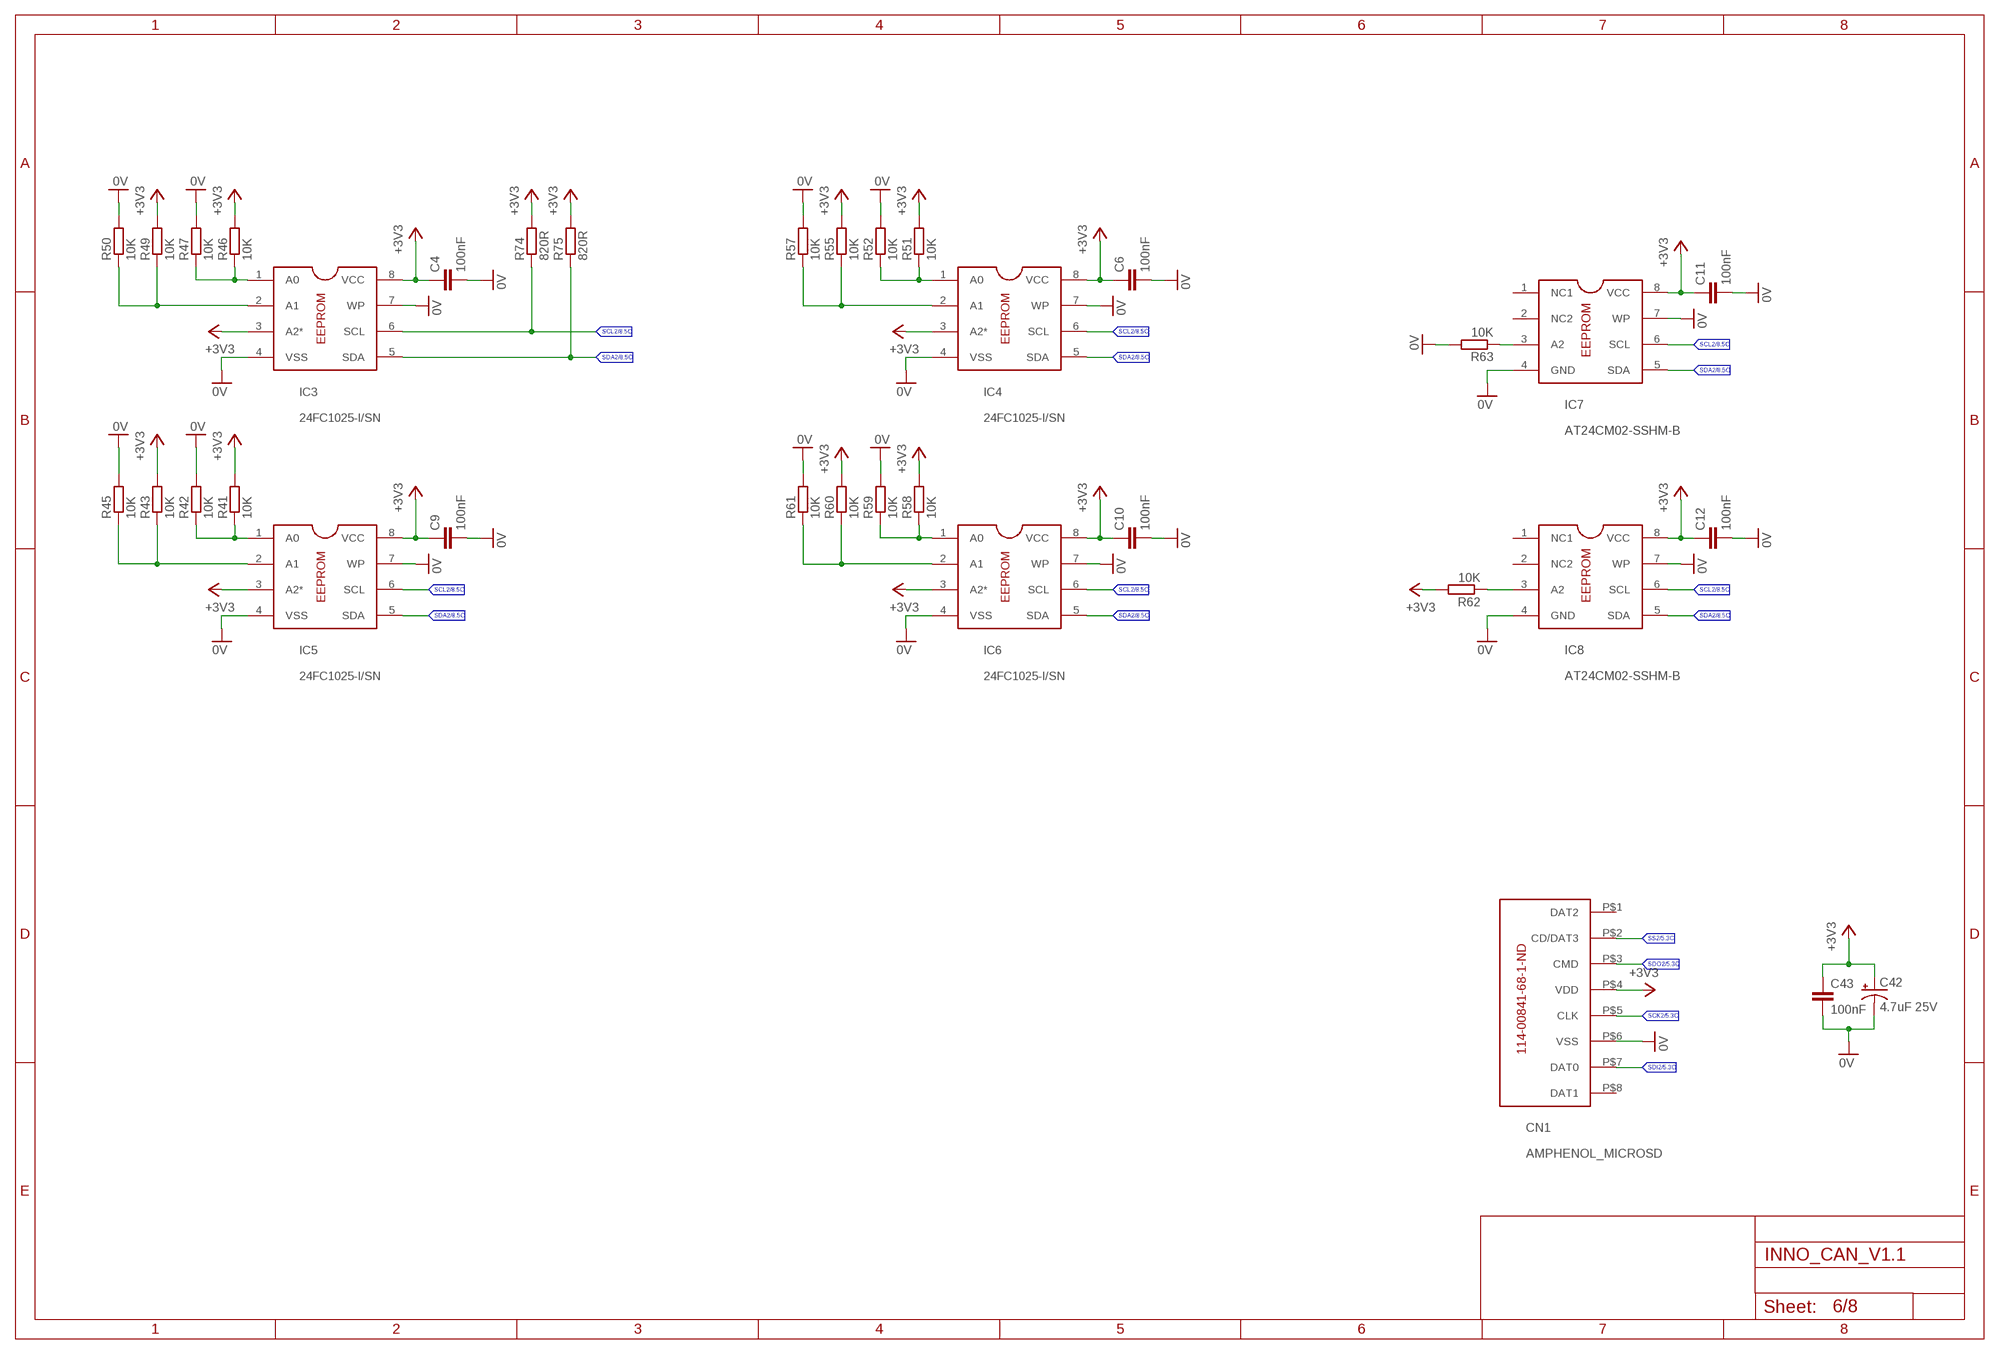
[diagram p5: schematic, sheet 6]

### Parts
C4  100nF  C-EUC0603  [C0603]
C6  100nF  C-EUC0603  [C0603]
C9  100nF  C-EUC0603  [C0603]
C10  100nF  C-EUC0603  [C0603]
C11  100nF  C-EUC0603  [C0603]
C12  100nF  C-EUC0603  [C0603]
C42  4.7uF 25V  CPOL-USA/3216-18R  [A/3216-18R]
C43  100nF  C-EUC0603  [C0603]
CN1  AMPHENOL_MICROSD  [AMPHENOL_MICROSD]
IC3  24FC1025-I/SN  [SOIC08]
IC4  24FC1025-I/SN  [SOIC08]
IC5  24FC1025-I/SN  [SOIC08]
IC6  24FC1025-I/SN  [SOIC08]
IC7  AT24CM02-SSHM-B  [SOIC08]
IC8  AT24CM02-SSHM-B  [SOIC08]
R41  10K  R-EU_R0603  [R0603]
R42  10K  R-EU_R0603  [R0603]
R43  10K  R-EU_R0603  [R0603]
R45  10K  R-EU_R0603  [R0603]
R46  10K  R-EU_R0603  [R0603]
R47  10K  R-EU_R0603  [R0603]
R49  10K  R-EU_R0603  [R0603]
R50  10K  R-EU_R0603  [R0603]
R51  10K  R-EU_R0603  [R0603]
R52  10K  R-EU_R0603  [R0603]
R55  10K  R-EU_R0603  [R0603]
R57  10K  R-EU_R0603  [R0603]
R58  10K  R-EU_R0603  [R0603]
R59  10K  R-EU_R0603  [R0603]
R60  10K  R-EU_R0603  [R0603]
R61  10K  R-EU_R0603  [R0603]
R62  10K  R-EU_R0603  [R0603]
R63  10K  R-EU_R0603  [R0603]
R74  820R  R-EU_R0603  [R0603]
R75  820R  R-EU_R0603  [R0603]

### Nets
0V: C4.2 C6.2 C9.2 C10.2 C11.2 C12.2 C42.- C43.2 CN1.P$6(VSS) IC3.4(VSS) IC3.7(WP) IC4.4(VSS) IC4.7(WP) IC5.4(VSS) IC5.7(WP) IC6.4(VSS) IC6.7(WP) IC7.4(GND) IC7.7(WP) IC8.4(GND) IC8.7(WP) R42.2 R45.2 R47.2 R50.2 R52.2 R57.2 R59.2 R61.2 R63.2 ; also sheet 1,2,3,4,5,7,8
+3V3: C4.1 C6.1 C9.1 C10.1 C11.1 C12.1 C42.+ C43.1 CN1.P$4(VDD) IC3.3(A2*) IC3.8(VCC) IC4.3(A2*) IC4.8(VCC) IC5.3(A2*) IC5.8(VCC) IC6.3(A2*) IC6.8(VCC) IC7.8(VCC) IC8.8(VCC) R41.2 R43.2 R46.2 R49.2 R51.2 R55.2 R58.2 R60.2 R62.2 R74.2 R75.2 ; also sheet 1,3,4,5,7,8
N$27: IC5.1(A0) R41.1 R42.1
N$29: IC5.2(A1) R43.1 R45.1
N$30: IC3.1(A0) R46.1 R47.1
N$31: IC3.2(A1) R49.1 R50.1
N$32: IC4.2(A1) R55.1 R57.1
N$33: IC4.1(A0) R51.1 R52.1
N$35: IC6.1(A0) R58.1 R59.1
N$36: IC6.2(A1) R60.1 R61.1
N$45: IC8.3(A2) R62.1
N$46: IC7.3(A2) R63.1
SCK2: CN1.P$5(CLK) ; also sheet 5
SCL2: IC3.6(SCL) IC4.6(SCL) IC5.6(SCL) IC6.6(SCL) IC7.6(SCL) IC8.6(SCL) R74.1 ; also sheet 5,8
SDA2: IC3.5(SDA) IC4.5(SDA) IC5.5(SDA) IC6.5(SDA) IC7.5(SDA) IC8.5(SDA) R75.1 ; also sheet 5,8
SDI2: CN1.P$7(DAT0) ; also sheet 5
SDO2: CN1.P$3(CMD) ; also sheet 5
SS2: CN1.P$2(CD/DAT3) ; also sheet 5
Unconnected: CN1.P$1(DAT2) CN1.P$8(DAT1) IC7.1(NC1) IC7.2(NC2) IC8.1(NC1) IC8.2(NC2)

### Notes on the sheet
- 114-00841-68-1-ND

## Sheet 7 of 8: ETHERNET
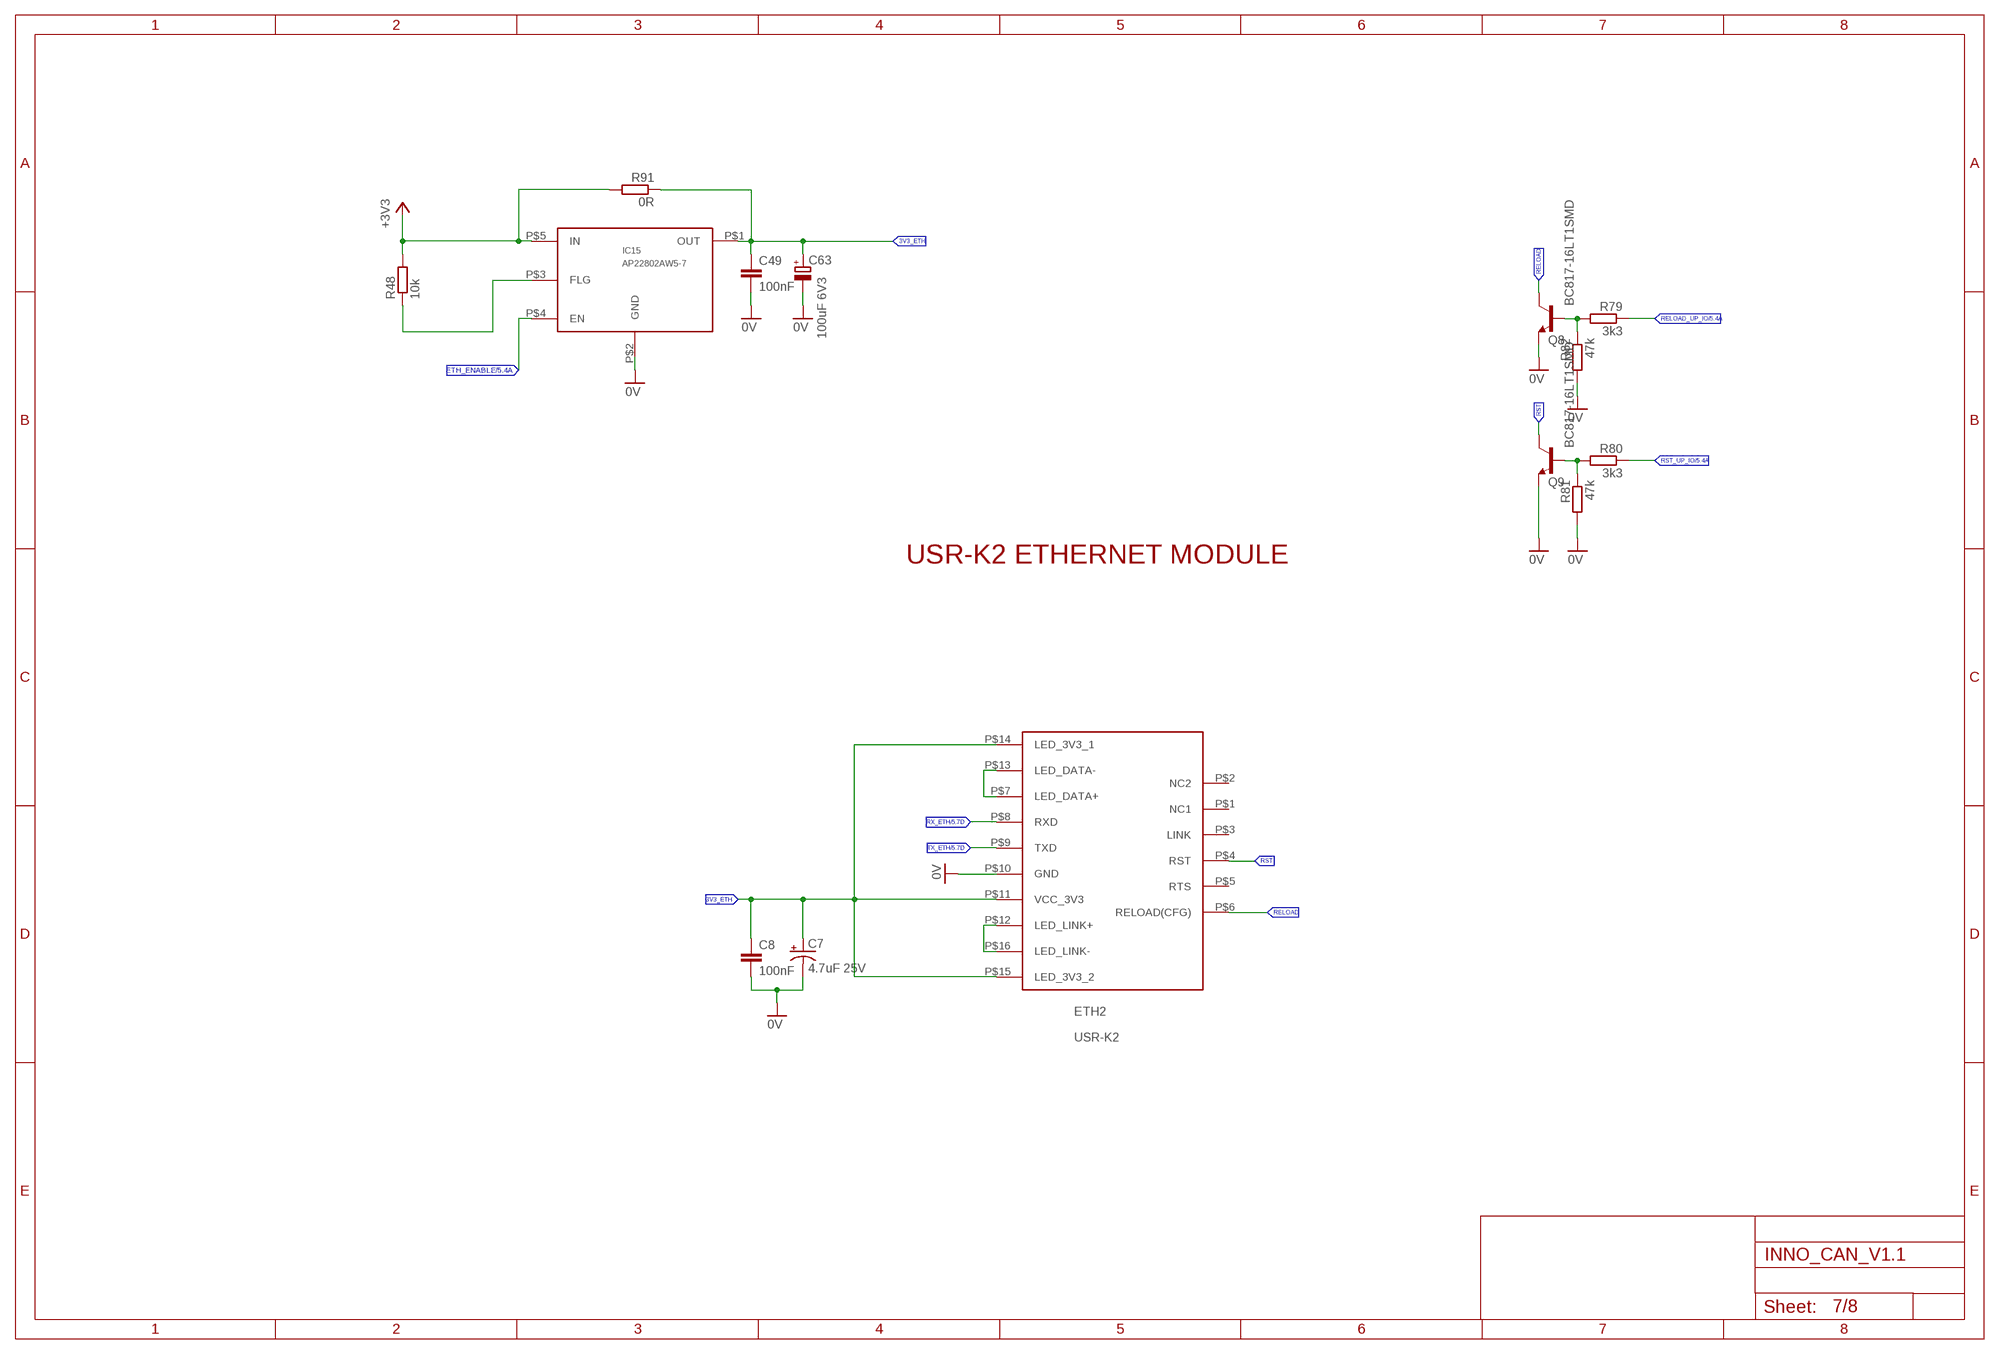
[diagram p6: schematic, sheet 7]

### Parts
C7  4.7uF 25V  CPOL-USA/3216-18R  [A/3216-18R]
C8  100nF  C-EUC0603  [C0603]
C49  100nF  C-EUC0603  [C0603]
C63  100uF 6V3  CPOL-EUE5-5  [E5-5]
ETH2  USR-K2  [USR-K2]
IC15  AP22802AW5-7  [SOT23-5L]
Q8  BC817-16LT1SMD  [SOT23-BEC]
Q9  BC817-16LT1SMD  [SOT23-BEC]
R48  10k  R-EU_R0603  [R0603]
R79  3k3  R-EU_R0805  [R0805]
R80  3k3  R-EU_R0805  [R0805]
R81  47k  R-EU_R0805  [R0805]
R82  47k  R-EU_R0805  [R0805]
R91  0R  R-EU_R0805  [R0805]

### Nets
0V: C7.- C8.2 C49.2 C63.- ETH2.P$10(GND) IC15.P$2(GND) Q8.E Q9.E R81.2 R82.2 ; also sheet 1,2,3,4,5,6,8
3V3_ETH: C7.+ C8.1 C49.1 C63.+ ETH2.P$11(VCC_3V3) ETH2.P$14(LED_3V3_1) ETH2.P$15(LED_3V3_2) IC15.P$1(OUT) R91.1
+3V3: IC15.P$5(IN) R48.2 R91.2 ; also sheet 1,3,4,5,6,8
ETH_ENABLE: IC15.P$4(EN) ; also sheet 5
N$8: ETH2.P$12(LED_LINK+) ETH2.P$16(LED_LINK-)
N$9: ETH2.P$7(LED_DATA+) ETH2.P$13(LED_DATA-)
N$28: IC15.P$3(FLG) R48.1
RELOAD: ETH2.P$6(RELOAD(CFG)) Q8.C
RELOAD_UP_IO: R79.1 ; also sheet 5
RST: ETH2.P$4(RST) Q9.C
RST_UP_IO: R80.1 ; also sheet 5
RX_ETH: ETH2.P$8(RXD) ; also sheet 5
TX_ETH: ETH2.P$9(TXD) ; also sheet 5
TXD2: Q8.B R79.2 R82.1
TXD3: Q9.B R80.2 R81.1
Unconnected: ETH2.P$1(NC1) ETH2.P$2(NC2) ETH2.P$3(LINK) ETH2.P$5(RTS)

### Notes on the sheet
- USR-K2 ETHERNET MODULE

## Sheet 8 of 8: RTC LAYER
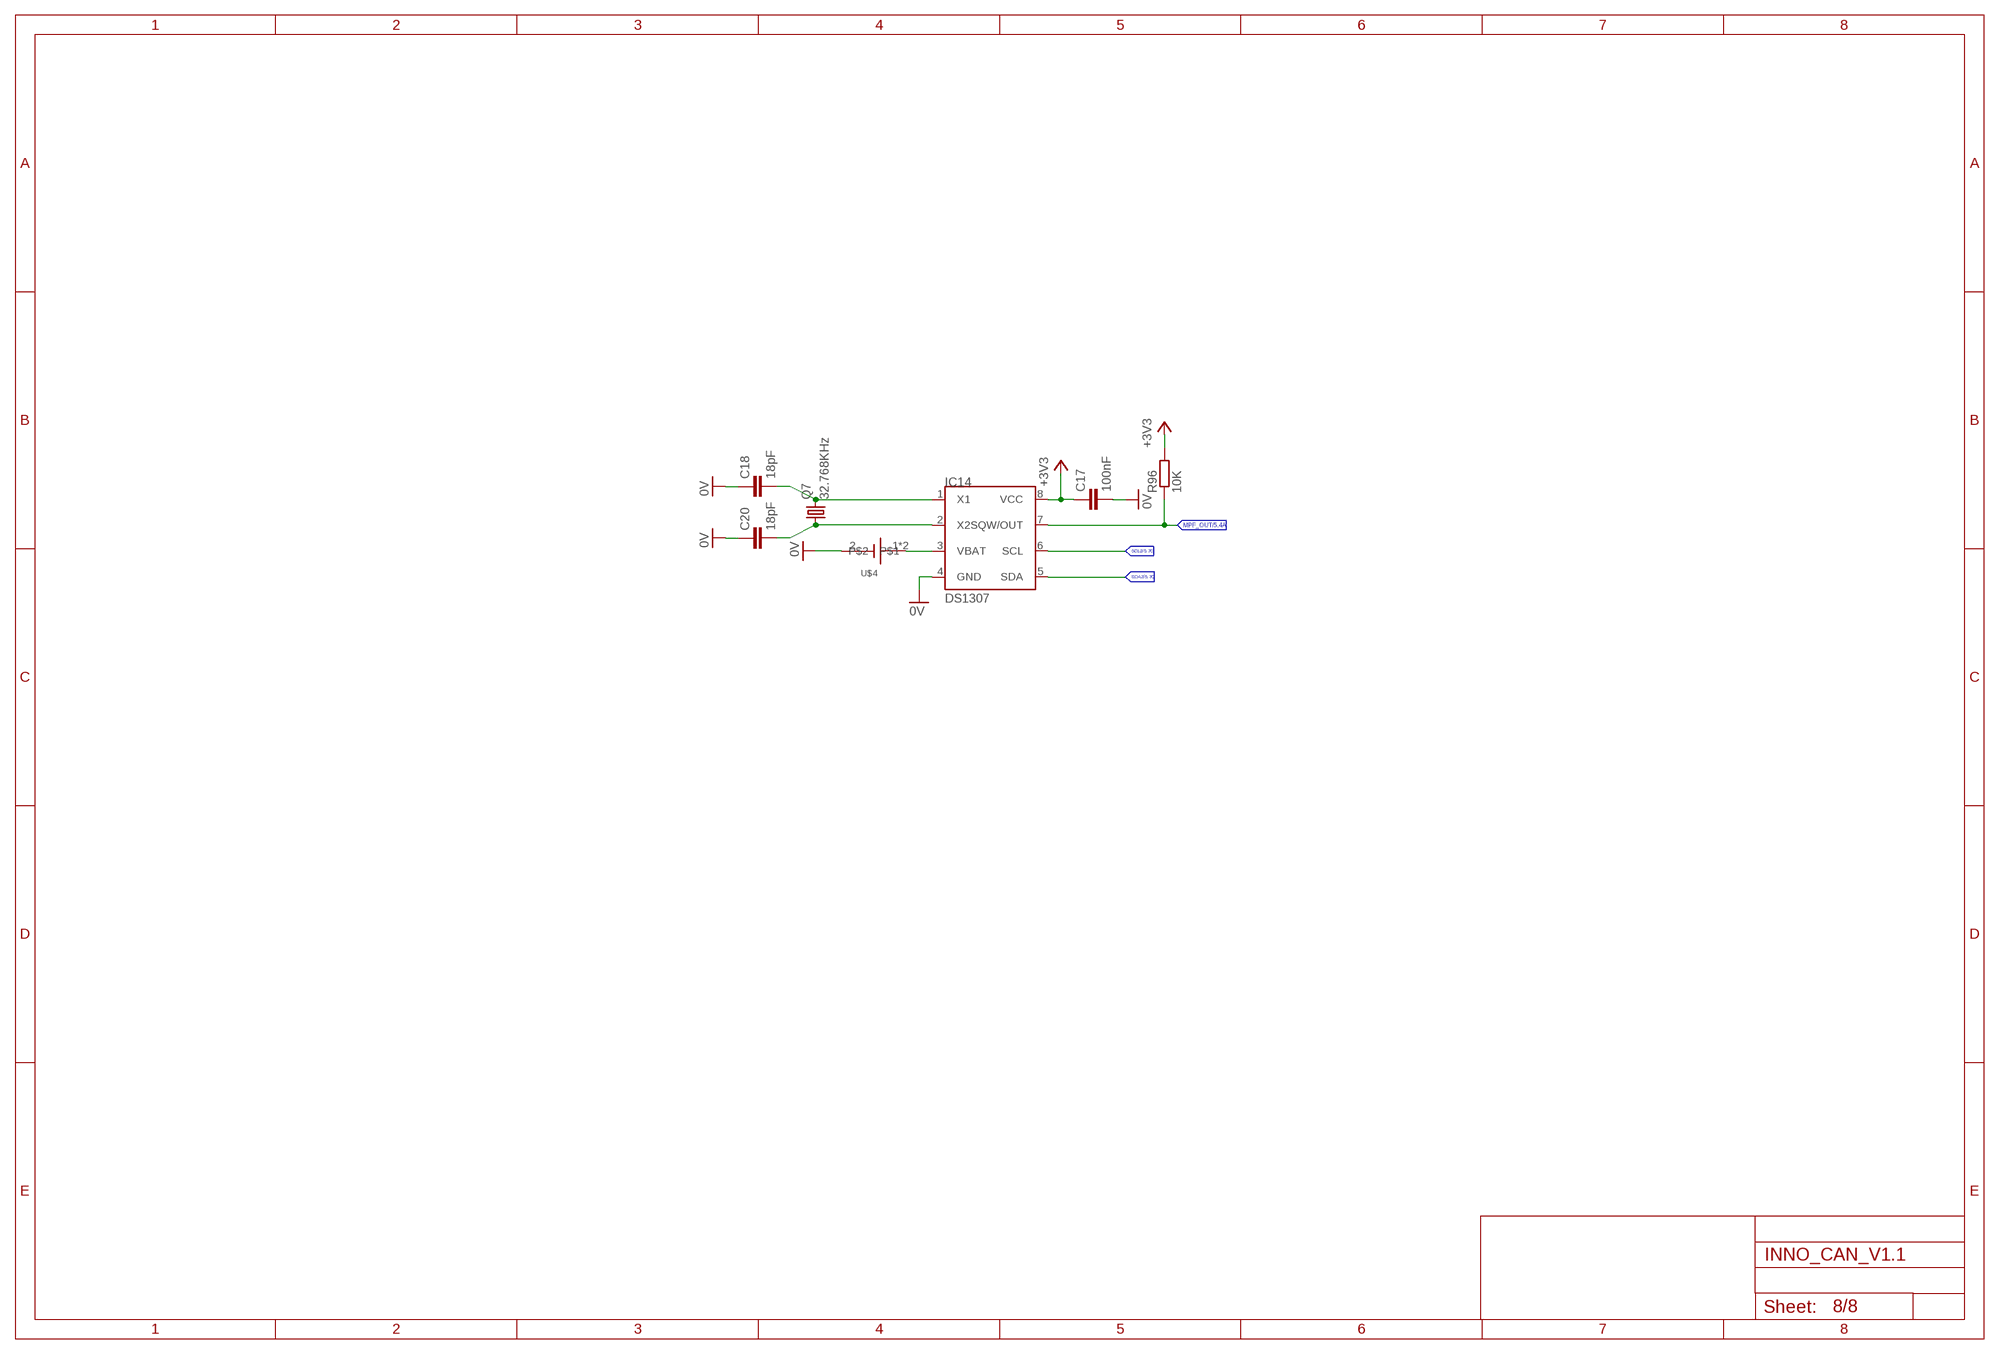
[diagram p7: schematic, sheet 8]

### Parts
C17  100nF  C-EUC0603K  [C0603K]
C18  18pF  C-EUC0603  [C0603]
C20  18pF  C-EUC0603  [C0603]
IC14  DS1307  [SOIC-8]
Q7  32.768KHz  CRYSTALTC26V  [TC26V]
R96  10K  R-EU_R0603  [R0603]
U$4  BATTERY  [BATTERY]

### Nets
0V: C17.2 C18.1 C20.1 IC14.4(GND) U$4.2 ; also sheet 1,2,3,4,5,6,7
+3V3: C17.1 IC14.8(VCC) R96.2 ; also sheet 1,3,4,5,6,7
MPF_OUT: IC14.7(SQW/OUT) R96.1 ; also sheet 5
N$51: C18.2 IC14.1(X1) Q7.2
N$54: C20.2 IC14.2(X2) Q7.1
N$139: IC14.3(VBAT) U$4.1 U$4.3
SCL2: IC14.6(SCL) ; also sheet 5,6
SDA2: IC14.5(SDA) ; also sheet 5,6

## Library data of the parts
C1-C4 C6 C8-C18 C20 C23-C34 C36 C43 C45 C49 = rcl:C-EU: CAPACITOR, European symbol
C5 C19 C40 C41 C46 C48 C59 C61-C63 = rcl:CPOL-EU: POLARIZED CAPACITOR, European symbol
C7 C35 C42 = rcl:CPOL-US: POLARIZED CAPACITOR, American symbol
CN1 = Alihan_1_lib:AMPHENOL_MICROSD
CN2 = Alihan_1_lib:3003-12
D2 = diode:GF1: DIODE
ETH2 = USR-K2:USR-K2
IC1 = Aktif_Lib:LM2596: SIMPLE SWITCHER® Power Converter 150 kHz 3A Step-Down Voltage Regulator Source: http://www.national.com/ds/LM/LM2596.pdf; MF: NATIONAL SEMICONDUCTOR; MPN: LM2596S-ADJ/NOPB; OC_FARNELL: 9494367; OC_NEWARK: 41K3842
IC2 = Alihan_1_lib:PIC32MX795F512L-80I/PF
IC3-IC6 = Alihan_1_lib:24FC1025-I/SN
IC7 IC8 = Alihan_1_lib:AT24CM02-SSHM-B
IC9 IC11 = Alihan_1_lib:MCP2551T-E/SN
IC10 IC12 = 751xx:75176A: DIFFERENTIAL BUS TRANSCEIVER Source: http://focus.ti.com/lit/ds/symlink/sn75176a.pdf
IC13 = maxim:MAX3232*: True RS-232 Transceivers 3.0V to 5.5V, Low-Power up to 1Mbps, Using Four 0.1µF External Capacitors Source: http://pdfserv.maxim-ic.com/en/ds/MAX3222-MAX3241.pdf; MPN: MAX3232CSE; OC_FARNELL: 9725490; OC_NEWARK: 90C2890
IC14 = dallas-1:DS1307: I2C Serial RTC w/56 bytes battery backed RAM
IC15 = Alihan_1_lib:AP22802AW5-7
ICSP = pinhead:PINHD-1X5: PIN HEADER
L2 = inductors:DR127: High Power Density, High Efficiency, Shielded Inductors Source: coiltronics_dr_series.pdf
L3 R1-R98 = rcl:R-EU_: RESISTOR, European symbol
LED1-LED7 = led:LED: LED OSRAM: - CHIPLED LG R971, LG N971, LY N971, LG Q971, LY Q971, LO R971, LY R971 LH N974, LH R974 LS Q976, LO Q976, LY Q976 LO Q996 - Hyper CHIPLED LW Q18S LB Q993, LB Q99A, LB R99A - SideLED LS A670, LO A670, LY A670, LG A670, LP A670 LB A673, LV A673, LT A673, LW A673 LH A674 LY A675 LS A676, LA A676, LO A676, LY A676, LW A676 LS A679, LY A679, LG A679 - Hyper Micro SIDELED® LS Y876, LA Y876, LO Y876, LY Y876 LT Y87S - SmartLED LW L88C, LW L88S LB L89C, LB L89S, LG L890 LS L89K, LO L89K, LY L89K LS L896, LA L896, LO L896, LY L896 - TOPLED LS T670, LO T670, LY T670, LG T670, LP T670 LSG T670, LSP T670, LSY T670, LOP T670, LYG T670 LG T671, LOG T671, LSG T671 LB T673, LV T673, LT T673, LW T673 LH T674 LS T676, LA T676, LO T676, LY T676, LB T676, LH T676, LSB T676, LW T676 LB T67C, LV T67C, LT T67C, LS T67K, LO T67K, LY T67K, LW E67C LS E67B, LA E67B, LO E67B, LY E67B, LB E67C, LV E67C, LT E67C LW T67C LS T679, LY T679, LG T679 LS T770, LO T770, LY T770, LG T770, LP T770 LB T773, LV T773, LT T773, LW T773 LH T774 LS E675, LA E675, LY E675, LS T675 LS T776, LA T776, LO T776, LY T776, LB T776 LHGB T686 LT T68C, LB T68C - Hyper Mini TOPLED® LB M676 - Mini TOPLED Santana® LG M470 LS M47K, LO M47K, LY M47K Source: http://www.osram.convergy.de LUXEON: - LUMILED® LXK2-PW12-R00, LXK2-PW12-S00, LXK2-PW14-U00, LXK2-PW14-V00 LXK2-PM12-R00, LXK2-PM12-S00, LXK2-PM14-U00 LXK2-PE12-Q00, LXK2-PE12-R00, LXK2-PE12-S00, LXK2-PE14-T00, LXK2-PE14-U00 LXK2-PB12-K00, LXK2-PB12-L00, LXK2-PB12-M00, LXK2-PB14-N00, LXK2-PB14-P00, LXK2-PB14-Q00 LXK2-PR12-L00, LXK2-PR12-M00, LXK2-PR14-Q00, LXK2-PR14-R00 LXK2-PD12-Q00, LXK2-PD12-R00, LXK2-PD12-S00 LXK2-PH12-R00, LXK2-PH12-S00 LXK2-PL12-P00, LXK2-PL12-Q00, LXK2-PL12-R00 Source: www.luxeon.com KINGBRIGHT: KA-3528ASYC Source: www.kingbright.com
OK1-OK6 OK11 OK14 = optocoupler:LTV816: OPTO COUPLER Source: LITEON, LTV816.pdf; OC_FARNELL: unknown; OC_NEWARK: unknown
Q1 Q4 Q5 Q8 Q9 = transistor-npn:BC817*: NPN Transistor
Q2 Q3 Q7 = crystal:CRYSTAL: CRYSTAL; OC_FARNELL: unknown; OC_NEWARK: unknown
SV1 = con-lstb:MA03-1: PIN HEADER; OC_FARNELL: unknown; OC_NEWARK: unknown
T3 T6 = transistor-neu-to92:*-NPN-: NPN Transistror
U$1 U$3 = Aktif_Lib:DF3D18FU,LF
U$4 = Aktif_Lib:BATTERY
U$13 = Alihan_1_lib:B540C_DIODE